# EAGLE design FloppyCircuits_X01 (EAGLE 9.5.1)
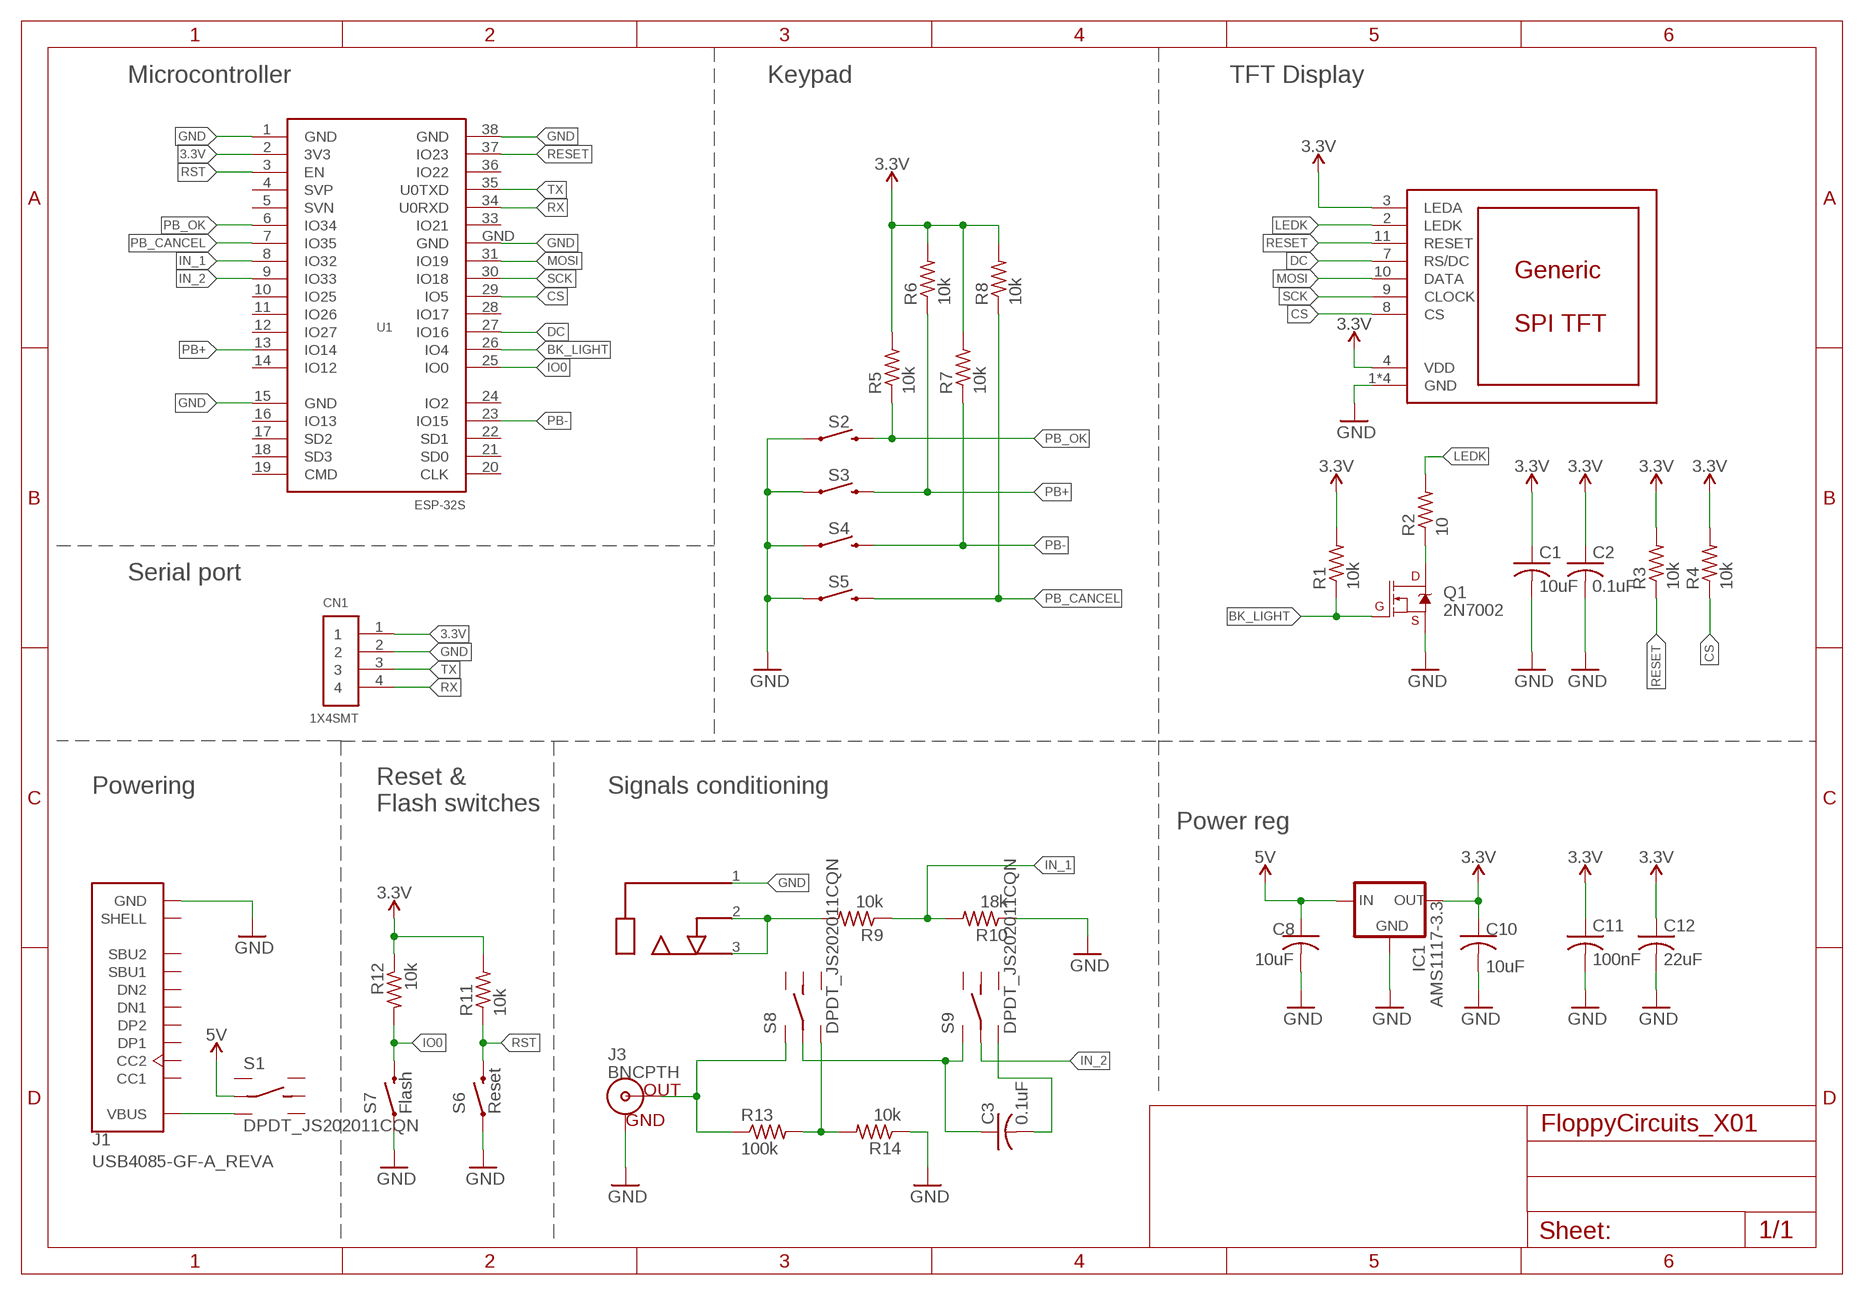
[diagram p0: schematic, sheet 1]

## Parts
C1  10uF  C-USC0603  [C0603]
C2  0.1uF  C-USC0603  [C0603]
C3  0.1uF  C-USC0603  [C0603]
C8  10uF  C-USC0603  [C0603]
C10  10uF  C-USC0603  [C0603]
C11  100nF  C-USC0603  [C0603]
C12  22uF  C-USC0603  [C0603]
CN1  1X4SMT  [1X4-SMT]
DISP1  DISP_LCD_GENERIC_SPI_1.69_WRAPUNDER  [TFT_1.69IN_240X280_12P]
IC1  AMS1117-3.3  V_REG_LD1117VXXLD1117-SMD  [SOT223]
J1  USB4085-GF-A_REVA  [GCT_USB4085-GF-A_REVA]
J2  AUDIO_JACK_MONO_3.5  [PJ316_3.5]
J3  BNCPTH  [BNC]
Q1  2N7002  MOSFET-NCH-BSS138  [SOT23-3]
R1  10k  R-US_R0603  [R0603]
R2  10  R-US_R0603  [R0603]
R3  10k  R-US_R0603  [R0603]
R4  10k  R-US_R0603  [R0603]
R5  10k  R-US_R0603  [R0603]
R6  10k  R-US_R0603  [R0603]
R7  10k  R-US_R0603  [R0603]
R8  10k  R-US_R0603  [R0603]
R9  10k  R-US_R0603  [R0603]
R10  18k  R-US_R0603  [R0603]
R11  10k  R-US_R0603  [R0603]
R12  10k  R-US_R0603  [R0603]
R13  100k  R-US_R0603  [R0603]
R14  10k  R-US_R0603  [R0603]
S1  DPDT_JS202011CQN  [DPDT_JS202011CQN]
S2  MOMENTARY-SWITCH-SPST-PTH-6.0MM  [TACTILE_SWITCH_PTH_6.0MM]
S3  MOMENTARY-SWITCH-SPST-PTH-6.0MM  [TACTILE_SWITCH_PTH_6.0MM]
S4  MOMENTARY-SWITCH-SPST-PTH-6.0MM  [TACTILE_SWITCH_PTH_6.0MM]
S5  MOMENTARY-SWITCH-SPST-PTH-6.0MM  [TACTILE_SWITCH_PTH_6.0MM]
S6  Reset  MOMENTARY-SWITCH-SPST-SMD-5.2MM-TALL  [TACTILE_SWITCH_SMD_5.2MM]
S7  Flash  MOMENTARY-SWITCH-SPST-SMD-5.2MM-TALL  [TACTILE_SWITCH_SMD_5.2MM]
S8  DPDT_JS202011CQN  [DPDT_JS202011CQN]
S9  DPDT_JS202011CQN  [DPDT_JS202011CQN]
U1  ESP-32S  [ESP-32S]

## Nets
3.3V [power]: C1.1 C2.1 C10.1 C11.1 C12.1 CN1.1 DISP1.3(LEDA) DISP1.4(VDD) IC1.2(OUT) R1.2 R3.2 R4.2 R5.2 R6.2 R7.2 R8.2 R11.2 R12.1 U1.2(3V3)
5V: C8.1 IC1.3(IN) S1.2(LC)
BK_LIGHT: Q1.1(G) R1.1 U1.26(IO4)
CS: DISP1.8(CS) R4.1 U1.29(IO5)
DC: DISP1.7(RS/DC) U1.27(IO16)
GND: C1.2 C2.2 C8.2 C10.2 C11.2 C12.2 CN1.2 DISP1.1(GND) DISP1.5(GND) DISP1.6(GND) DISP1.12(GND) IC1.1(GND) J1.A1(GND) J1.A12(GND) J1.B1(GND) J1.B12(GND) J2.1 J3.GND Q1.2(S) R10.1 R14.1 S2.1 S3.1 S4.1 S5.1 S6.1 S7.1 U1.1(GND) U1.15(GND) U1.38(GND) U1.GND
IN_1: R9.1 R10.2 U1.8(IO32)
IN_2: S9.2(LC) U1.9(IO33)
INPUT: J2.2 J2.3 R9.2
IO0: R12.2 S7.3 U1.25(IO0)
LEDK: DISP1.2(LEDK) R2.2
MOSI: DISP1.10(DATA) U1.31(IO19)
N$1: Q1.3(D) R2.1
N$2: J3.S(OUT) R13.1 S8.1(L1)
N$3: R13.2 R14.2 S8.3(L2)
N$5: J1.A4(VBUS) J1.A9(VBUS) J1.B4(VBUS) J1.B9(VBUS) S1.3(L2)
N$6: C3.1 S8.2(LC) S9.1(L1)
N$8: C3.2 S9.3(L2)
PB+: R6.1 S3.3 U1.13(IO14)
PB-: R7.1 S4.3 U1.23(IO15)
PB_CANCEL: R8.1 S5.3 U1.7(IO35)
PB_OK: R5.1 S2.3 U1.6(IO34)
RESET: DISP1.11(RESET) R3.1 U1.37(IO23)
RST: R11.1 S6.3 U1.3(EN)
RX: CN1.4 U1.34(U0RXD)
SCK: DISP1.9(CLOCK) U1.30(IO18)
TX: CN1.3 U1.35(U0TXD)
Unconnected: J1.A5(CC1) J1.A6(DP1) J1.A7(DN1) J1.A8(SBU1) J1.B5(CC2) J1.B6(DP2) J1.B7(DN2) J1.B8(SBU2) J1.P1(SHELL) J1.P2(SHELL) J1.P3(SHELL) J1.P4(SHELL) S1.1(L1) S1.4(R1) S1.5(RC) S1.6(R2) S8.4(R1) S8.5(RC) S8.6(R2) S9.4(R1) S9.5(RC) S9.6(R2) U1.4(SVP) U1.5(SVN) U1.10(IO25) U1.11(IO26) U1.12(IO27) U1.14(IO12) U1.16(IO13) U1.17(SD2) U1.18(SD3) U1.19(CMD) U1.20(CLK) U1.21(SD0) U1.22(SD1) U1.24(IO2) U1.28(IO17) U1.33(IO21) U1.36(IO22)

## Notes on the sheet
- Microcontroller | Keypad | TFT Display
- Serial port
- Powering | Signals conditioning
- Reset & 
  Flash switches
- Power reg

## Library data of the parts
C1-C3 C8 C10-C12 = rcl:C-US: CAPACITOR, American symbol; SPICEPREFIX: C
CN1 = adafruit:1X4: 4-pin connector
DISP1 = adafruit_display:DISP_LCD_GENERIC_SPI
IC1 = SparkFun-IC-Power:V_REG_LD1117VXX: LD1117VXX voltage regulator. We carry the 3.3V version (COM-00526) in TO-220 package.; PROD_ID: VREG-13917
J1 = SpaceDIY_connectors:USB4085-GF-A_REVA: USB 2.0 Type C Receptacle Dip Type, PCB Top Mount Check prices <https://pricing.snapeda.com/parts/USB4085-GF-A/Global%20Connector%20Technology/view-part?ref=eda>; AVAILABILITY: In Stock; DESCRIPTION: USB-C (USB TYPE-C) USB 2.0 Receptacle Connector 24 (16+8 Dummy) Position Through Hole, Right Angle, low cost, 3.46mm profile, 16 pin, horizontal, Top mount; MF: Global Connector Technology; MP: USB4085-GF-A; PACKAGE: None; PRICE: None; PURCHASE-URL: https://pricing.snapeda.com/search/part/USB4085-GF-A/?ref=eda
J2 = SpaceDIY_connectors:AUDIO_JACK_MONO_3.5
J3 = SparkFun:BNC: BNC Connector, Mouser Part# 5227161
Q1 = SparkFun-DiscreteSemi:MOSFET-NCH: N-channel MOSFETs Voltage controlled devices that allow control of high current outputs. SparkFun Products: SparkFun OpenScale <https://www.sparkfun.com/products/13261> SparkFun Digital Sandbox <https://www.sparkfun.com/products/12651> SparkFun Monster Moto Shield <https://www.sparkfun.com/products/10182> SparkFun MOSFET Power Controller <https://www.sparkfun.com/products/11214>; PROD_ID: TRANS-00830; VALUE: 220mA/50V/3.5Ω
R1-R14 = rcl:R-US_: RESISTOR, American symbol; SPICEPREFIX: R
S1 S8 S9 = bt_electromech:DPDT: Dual Position, Dual Throw (DPDT) Switch
S2-S5 = SparkFun-Switches:MOMENTARY-SWITCH-SPST: Momentary Switch (Pushbutton) - SPST Normally-open (NO) SPST momentary switches (buttons, pushbuttons). Variants PTH-12MM - 12mm square, through-hole Momentary Pushbutton Switch - 12mm Square <https://www.sparkfun.com/products/9190> (COM-09190) PTH-6.0MM, PTH-6.0MM-KIT - 6.0mm square, through-hole Mini Pushbutton Switch <https://www.sparkfun.com/products/97> (COM-00097) KIT package intended for soldering kit's - only one side of pads' copper is exposed. PTH-RIGHT-ANGLE-KIT - Right-angle, through-hole Right Angle Tactile Button <https://www.sparkfun.com/products/10791> - Used on SparkFun BigTime Watch Kit <https://www.sparkfun.com/products/11734> SMD-12MM - 12mm square, surface-mount Tactile Button - SMD (12mm) <https://www.sparkfun.com/products/12993> (COM-12993) Used on SparkFun PicoBoard <https://www.sparkfun.com/products/11888> SMD-4.5MM - 4.5mm Square Trackball Switch Used on SparkFun Blackberry Trackballer Breakout <https://www.sparkfun.com/products/13169> SMD-4.6MMX2.8MM - 4.60mm x 2.80mm, surface mount Used on SparkFun Pro Micro - RP2040 <https://www.sparkfun.com/products/17717> SMD-5.2MM, SMD-5.2-REDUNDANT - 5.2mm square, surface-mount Mini Pushbutton Switch - SMD <https://www.sparkfun.com/products/8720> (COM-08720) Used on Arduino Pro Mini <https://www.sparkfun.com/products/11114> REDUNDANT package connects both switch circuits together SMD-6.0X3.5MM - 6.0 x 3.5mm, surface mount Momentary Reset Switch SMD <https://www.sparkfun.com/products/8229> (COM-08229) SMD-6.2MM-TALL - 6.2mm square, surface mount Tactile Button - SMD (6mm) <https://www.sparkfun.com/products/12992> Used on SparkFun Digital Sandbox <https://www.sparkfun.com/products/12651> SMD-RIGHT-ANGLE - Right-angle, surface mount Used on SparkFun Block for Intel® Edison - Arduino <https://www.sparkfun.com/products/13036>; PROD_ID: SWCH-08441; SF_SKU: COM-00097
S6 S7 = SpaceDIY_electromechanical:MOMENTARY-SWITCH-SPST: Momentary Switch (Pushbutton) - SPST Normally-open (NO) SPST momentary switches (buttons, pushbuttons). Variants PTH-12MM - 12mm square, through-hole Momentary Pushbutton Switch - 12mm Square <https://www.sparkfun.com/products/9190> (COM-09190) PTH-6.0MM, PTH-6.0MM-KIT - 6.0mm square, through-hole Mini Pushbutton Switch <https://www.sparkfun.com/products/97> (COM-00097) KIT package intended for soldering kit's - only one side of pads' copper is exposed. PTH-RIGHT-ANGLE-KIT - Right-angle, through-hole Right Angle Tactile Button <https://www.sparkfun.com/products/10791> - Used on SparkFun BigTime Watch Kit <https://www.sparkfun.com/products/11734> SMD-12MM - 12mm square, surface-mount Tactile Button - SMD (12mm) <https://www.sparkfun.com/products/12993> (COM-12993) Used on SparkFun PicoBoard <https://www.sparkfun.com/products/11888> SMD-4.5MM - 4.5mm Square Trackball Switch Used on SparkFun Blackberry Trackballer Breakout <https://www.sparkfun.com/products/13169> SMD-4.6MMX2.8MM - 4.60mm x 2.80mm, surface mount Used on SparkFun Pro Micro - RP2040 <https://www.sparkfun.com/products/17717> SMD-5.2MM, SMD-5.2-REDUNDANT - 5.2mm square, surface-mount Mini Pushbutton Switch - SMD <https://www.sparkfun.com/products/8720> (COM-08720) Used on Arduino Pro Mini <https://www.sparkfun.com/products/11114> REDUNDANT package connects both switch circuits together SMD-6.0X3.5MM - 6.0 x 3.5mm, surface mount Momentary Reset Switch SMD <https://www.sparkfun.com/products/8229> (COM-08229) SMD-6.2MM-TALL - 6.2mm square, surface mount Tactile Button - SMD (6mm) <https://www.sparkfun.com/products/12992> Used on SparkFun Digital Sandbox <https://www.sparkfun.com/products/12651> SMD-RIGHT-ANGLE - Right-angle, surface mount Used on SparkFun Block for Intel® Edison - Arduino <https://www.sparkfun.com/products/13036>; LCSC: C318884; PROD_ID: SWCH-14139
U1 = esp32:ESP-32S: Ai-Thinker ESP-32S

## Net classes
1 power: width 0.254 mm

## Board
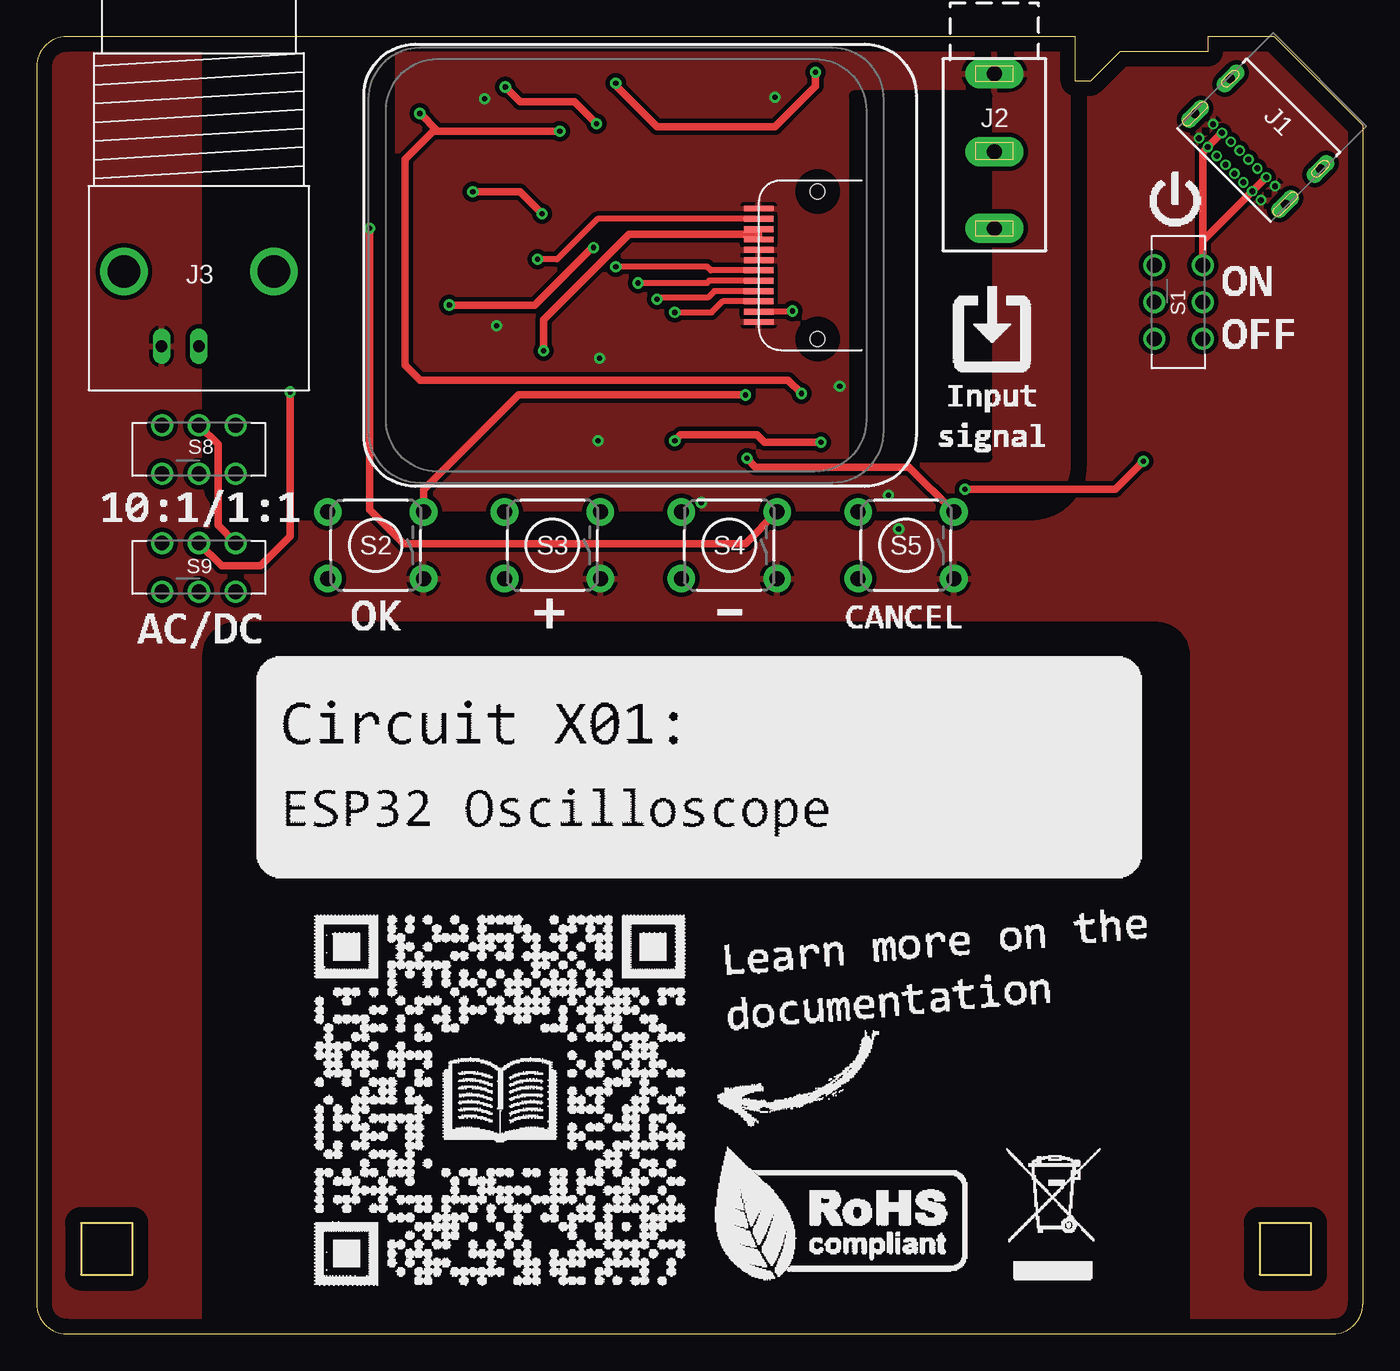
[diagram p1: board, top side]
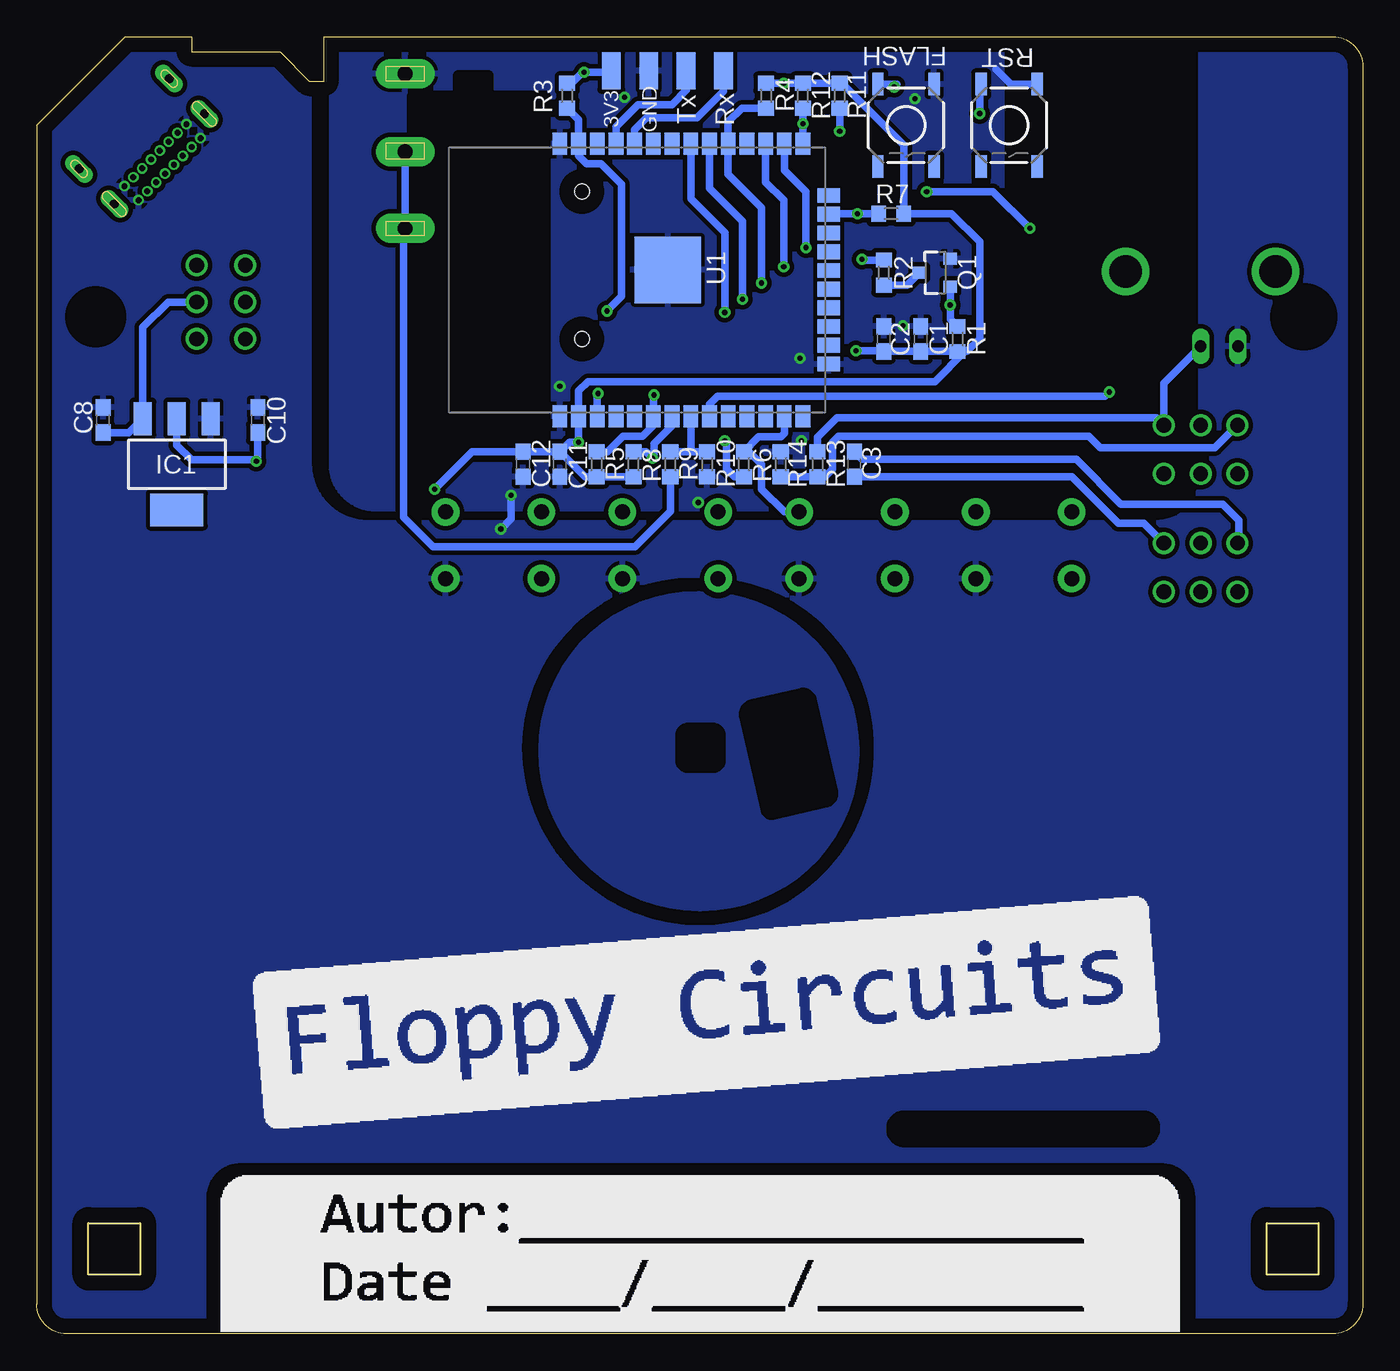
[diagram p2: board, bottom side, seen from below]

Size 90 x 88 mm. Coordinates in mm from the lower left corner, seen from the top.
Outline: 0,2 arc90 2,0 88,0 arc90 90,2 90,82 84,88 79.5,88 79.5,87 73.5,87 71.5,85 70.5,85 70.5,88 2,88 arc90 0,86 0,2
Outline: 3,4 6.5,4 6.5,7.5 3,7.5 3,4
Outline: 83,4 86.5,4 86.5,7.5 83,7.5 83,4
Copper layers (1*16): Top 0.035mm / dielectric 1.5mm / Bottom 0.035mm
Design rules "default *": minimum track width 6mil, minimum drill 0.35mm, track to track 6mil, track to pad 6mil, pad to pad 6mil, via to via 4mil, smd to smd 6mil, copper to edge 40mil, drill to drill 4mil, minimum pad ring 6mil, minimum via ring 8mil, stop-mask expansion 4mil, vias tented up to drill 0mil, thermal gap 10mil
tRestrict: area 55.5,59.5 to 64.5,84
bRestrict: area 55.5,59.5 to 64.5,85.4; area 36.1,35.3 to 41.9,43.4; area 43.7,38.5 to 46.2,41; area 14.1,13 to 32,14.8; area 3.3,68.3 to 4.7,69.7; area 85.5,68.5 to 86.5,69.5

### Footprints (pad centres in the part's own frame; a part is rotated, then mirrored left to right if it is on the bottom)
C0603 = smd 1.1 x 1: 1 -0.85,0; 2 0.85,0
1X4-SMT = smd 1.27 x 2.54: 1 -3.81,0; 2 -1.27,0; 3 1.27,0; 4 3.81,0
TFT_1.69IN_240X280_12P = smd 0.4 x 2: 1 3.85,-9; 2 3.15,-9; 3 2.45,-9; 4 1.75,-9; 5 1.05,-9; 6 0.35,-9; 7 -0.35,-9; 8 -1.05,-9; 9 -1.75,-9; 10 -2.45,-9; 11 -3.15,-9; 12 -3.85,-9 | hole 1: -5,-13; 5,-13
SOT223 = smd 1.219 x 2.235: 1 -2.311,-3.099; 2 0,-3.099; 3 2.311,-3.099 | smd 3.6 x 2.2: 4 0,3.099
GCT_USB4085-GF-A_REVA = drill 0.4 pad 0.65: A1 -2.975,4.025; A4 -2.125,4.025; A5 -1.275,4.025; A6 -0.425,4.025; A7 0.425,4.025; A8 1.275,4.025; A9 2.125,4.025; A12 2.975,4.025; B1 2.975,2.675; B4 2.125,2.675; B5 1.275,2.675; B6 0.425,2.675; B7 -0.425,2.675; B8 -1.275,2.675; B9 -2.125,2.675; B12 -2.975,2.675 | drill 0.6 pad 1.108 long: P1 -4.325,3.045; P2 4.325,3.045; P3 4.325,-0.335; P4 -4.325,-0.335
PJ316_3.5 = drill 1 pad 2 long: 1 0,1; 2 0,6.3; 3 0,11.5
BNC = drill 2.2: 3 -5.08,5.08; 4 5.08,5.08 | drill 0.8 long: GND -2.54,0; S 0,0
SOT23-3 = smd 0.8 x 0.9: 1 -0.95,-1; 2 0.95,-1; 3 0,1.1
R0603 = smd 1 x 1.1: 1 -0.85,0; 2 0.85,0
DPDT_JS202011CQN = drill 1: 1 -2.5,-1.65; 2 0,-1.651; 3 2.5,-1.65; 4 -2.5,1.65; 5 0,1.651; 6 2.5,1.65
TACTILE_SWITCH_PTH_6.0MM = drill 1.016 pad 1.88: 1 -3.251,2.261; 2 3.251,2.261; 3 -3.251,-2.261; 4 3.251,-2.261
TACTILE_SWITCH_SMD_5.2MM = smd 1.524 x 0.762: 1 -2.794,1.905; 2 2.794,1.905; 3 -2.794,-1.905; 4 2.794,-1.905
ESP-32S = smd 1.5 x 1: 1 -9.25,7; 2 -9.25,5.73; 3 -9.25,4.46; 4 -9.25,3.19; 5 -9.25,1.92; 6 -9.25,0.65; 7 -9.25,-0.62; 8 -9.25,-1.89; 9 -9.25,-3.16; 10 -9.25,-4.43; 11 -9.25,-5.7; 12 -9.25,-6.97; 13 -9.25,-8.24; 14 -9.25,-9.51; 25 9.25,-9.51; 26 9.25,-8.24; 27 9.25,-6.97; 28 9.25,-5.7; 29 9.25,-4.43; 30 9.25,-3.16; 31 9.25,-1.89; 32 9.25,-0.62; 33 9.25,0.65; 34 9.25,1.92; 35 9.25,3.19; 36 9.25,4.46; 37 9.25,5.73; 38 9.25,7 | smd 1 x 1.5: 15 -5.7,-11.25; 16 -4.43,-11.25; 17 -3.16,-11.25; 18 -1.89,-11.25; 19 -0.62,-11.25; 20 0.65,-11.25; 21 1.92,-11.25; 22 3.19,-11.25; 23 4.46,-11.25; 24 5.73,-11.25 | smd 4.5 x 4.5: GND 0.68,-0.33

### Placement (x,y rotation side)
C1  30,67.5 90 bottom
C2  32.5,67.5 90 bottom
C3  34.5,59 90 bottom
C8  85.5,62 90 bottom
C10  75,62 90 bottom
C11  54.5,59 270 bottom
C12  57,59 270 bottom
CN1  47.2,85.7 0 bottom
DISP1  40,72.5 90 top
IC1  80.5,59 180 bottom
J1  83.84,81.87 135 top
J2  65,86.5 180 top
J3  11,67 0 top
Q1  29,72 90 bottom
R1  27.5,67.5 270 bottom
R2  32.5,72 90 bottom
R3  54,84 90 bottom
R4  40.5,84 90 bottom
R5  52,59 270 bottom
R6  42,59 270 bottom
R7  32,76 0 bottom
R8  49.5,59 270 bottom
R9  47,59 270 bottom
R10  44.5,59 90 bottom
R11  35.5,84 90 bottom
R12  38,84 270 bottom
R13  37,59 270 bottom
R14  39.5,59 270 bottom
S1  77.5,70 90 top
S2  23,53.5 180 top
S3  35,53.5 180 top
S4  47,53.5 180 top
S5  59,53.5 180 top
S6  24,82 270 bottom
S7  31,82 270 bottom
S8  11,60 180 top
S9  11,52 180 top
U1  47.5,71.5 90 bottom

### Tracks (layer width: path | path; a pad name or v marks a point on that pad's centre or on a via)
3.3V  (via drill 0.35)
  Top 0.406: DISP1.3 DISP1.4
  Top 0.508: DISP1.4 49,74.6 40.2,74.6 34.4,68.8 v34.4,66.7 | v39.3,84.85 39.3,84.7 42.1,81.9 50.1,81.9 52.85,84.65 v52.85,85.6 | v53.23,60.5 49.4,60.5 48.9,61 43.7,61 v43.3,60.6 | v63,57.3 73.2,57.3 v75.1,59.2
  Bottom 0.508: C11.1 53.85,60.5 v53.23,60.5 U1.2 53.23,63.97 52.6,64.6 29.05,64.6 27,66.65 | C11.1 52.8,58.15 R5.2 R8.2 | C11.1 C12.1 60.45,59.85 v63,57.3 | v34.4,66.7 32.55,66.7 C2.1 C1.1 R1.2 27,66.65 | 27,66.65 26.85,66.65 26,67.5 26,74.1 27.9,76 R7.2 31.15,80.65 35.35,84.85 R11.2 R12.1 v39.3,84.85 R4.2 | R3.2 53.7,84.85 52.95,85.6 v52.85,85.6 51.11,85.6 CN1.1 | v43.3,60.6 43.2,60.5 43.2,58.7 42.65,58.15 R6.2 | v75.1,59.2 75,59.3 | 75,59.3 C10.1 | IC1.2 80.5,60.3 79.5,59.3 75,59.3
5V
  Bottom 0.508: C8.1 83.76,61.15 IC1.3 82.81,68.29 81.1,70 S1.2
BK_LIGHT  (via drill 0.35)
  Top 0.508: v37.8,73.7 37.75,73.75 33.8,69.8 v28,69.8
  Bottom 0.508: R1.1 28,68.85 v28,69.8 Q1.1 | U1.26 39.26,78.96 37.8,77.5 v37.8,73.7
CS  (via drill 0.35)
  Top 0.406: v40.8,71.3 45.5,71.3 45.65,71.45 DISP1.8
  Bottom 0.508: v40.8,71.3 40.8,76.4 43.07,78.67 U1.29 43.07,82.23 42.15,83.15 R4.1
DC  (via drill 0.35)
  Top 0.406: DISP1.7 45.75,72.15 45.5,72.4 v39.3,72.4
  Bottom 0.508: U1.27 40.53,78.13 39.3,76.9 v39.3,72.4
GND  (via drill 0.35)
  Bottom 0.508: S6.1 23.89,84.79 24.9,85.8 | v57.8,56.9 57.8,55.3 v58.5,54.6
  other vias: 31.2,68.4 38.2,66.2 38.1,60.6 45.1,56.4 54.5,64.3 30.4,83.8 50.1,83.9
  pour Top (isolate 0.305): 24.5,88 24.5,59 arc90 27.5,56 67,56 arc90 70,59 70,88
  pour Top (isolate 0.305): 11,88.5 11,58 arc90 14,55 67.5,55 arc90 71.5,59 71.5,88 91.5,88 91.5,-3 78.5,-3 78.5,46 arc90 76,48.5 13.5,48.5 arc90 11,46 11,-2.5 -2,-2.5 -2,88.5
  pour Bottom (isolate 0.305): 11,88.5 11,58 arc90 14,55 67.5,55 arc90 71.5,59 71.5,88 91.5,88 91.5,-3 78.67,-3 78.67,9.29 arc90 76.17,11.79 45,11.79 45,27.5 arc90 57.25,39.75 arc90 45.5,51.5 44.5,51.5 arc90 33,40 33,39.46 arc90 44.96,27.5 44.96,11.79 13.67,11.79 arc90 11.17,9.29 11.17,-2.5 -2,-2.5 -2,88.5
  pour Bottom (isolate 0.305): 70,88 70,59 arc-90 67,56 27.5,56 arc-90 24.5,59 24.5,88
GND_2
  pour Bottom (isolate 0.406): 44.98,50.35 arc90 34.2,39.58 34.2,39.41 arc90 44.89,28.71 45.06,28.71 arc90 55.92,39.58 arc90 45.15,50.35
IN_1
  Bottom 0.508: R10.2 45.7,59.85 | 45.7,59.85 R9.1 | U1.8 45.61,59.94 45.7,59.85
IN_2  (via drill 0.35)
  Top 0.508: S9.2 12.55,52.1 15.2,52.1 17.2,54.1 v17.2,63.9
  Bottom 0.508: v17.2,63.9 17.5,63.6 43.8,63.6 44.34,63.06 U1.9
INPUT
  Bottom 0.508: J2.2 65,75.3 | 65,75.3 J2.3 | R9.2 47,55.8 49.4,53.4 63.1,53.4 65.1,55.4 65.1,75.2 65,75.3
IO0  (via drill 0.35)
  Top 0.508: v31.8,84.6 32.8,83.6 36.5,83.6 v38,82.1
  Bottom 0.508: R12.2 v38,82.1 U1.25 | v31.8,84.6 31.61,84.79 S7.3
LEDK  (via drill 0.35)
  Top 0.406: DISP1.2 38.05,75.65 35.3,72.9 v34,72.9
  Bottom 0.508: R2.2 33.95,72.85 v34,72.9
MOSI  (via drill 0.35)
  Top 0.406: v43.3,69.3 45.8,69.3 46.55,70.05 DISP1.10
  Bottom 0.508: U1.31 45.61,77.01 43.3,74.7 v43.3,69.3
N$1
  Bottom 0.508: R2.1 30.95,71.15 Q1.3
N$2
  Bottom 0.508: J3.S 13.5,64.5 S8.1 14,62.15 35.68,62.15 37,60.83 R13.1
N$3
  Bottom 0.508: S8.3 10.05,60.1 17.8,60.1 18.6,60.9 35.6,60.9 36,60.5 36,58.65 36.5,58.15 R13.2 R14.2
N$5
  Top 0.508: J1.B9 J1.A4 79.15,74.17 | 79.15,74.17 79.15,74 S1.3 | J1.B4 J1.A9 79.15,80.19 79.15,74.17
N$6
  Top 0.508: S9.1 12.3,54.85 12.3,60.35 S8.2
  Bottom 0.508: S9.1 14.85,55 16.6,55 19.75,58.15 C3.1
N$8
  Bottom 0.508: C3.2 34,59.35 19.45,59.35 16.4,56.3 9.5,56.3 8.4,55.2 8.4,53.75 S9.3
PB+
  Bottom 0.508: U1.13 39.26,61.09 39.5,60.85 41,60.85 R6.1 41.65,59.85 40.8,59 40.8,57.31 39.25,55.76 S3.3
PB-  (via drill 0.35)
  Top 0.508: v22.6,75 22.6,55.9 24.9,53.6 48.09,53.6 S4.3 | v29.6,77.5 32.8,77.5 v34.3,76
  Bottom 0.508: R7.1 v34.3,76 36.21,76 U1.23 | v22.6,75 25.1,77.5 v29.6,77.5
PB_CANCEL  (via drill 0.35)
  Top 0.508: S5.3 59.21,58.8 48.8,58.8 v48.2,59.4
  Bottom 0.508: R8.1 48.65,59.85 v48.2,59.4 48.1,59.5 48.1,60.4 46.88,61.62 U1.7
PB_OK  (via drill 0.35)
  Top 0.508: S2.3 26.25,57.25 32.7,63.7 v48.1,63.7
  Bottom 0.508: R5.1 51.25,59.85 50.2,60.9 48.9,60.9 48.15,61.65 U1.6 48.15,63.65 v48.1,63.7
RESET  (via drill 0.35)
  Top 0.406: v51.3,69.4 51.25,69.35 DISP1.11
  Bottom 0.508: R3.1 53.23,82.38 U1.37 53.23,79.93 52.7,79.4 51.7,79.4 50.3,78 50.3,70.4 v51.3,69.4
RST  (via drill 0.35)
  Top 0.508: v35.5,81.6 27.2,81.6 | 27.2,81.6 v26,82.8 | v51.9,63.8 51,64.7 26,64.7 25,65.7 25,79.7 26.9,81.6 27.2,81.6
  Bottom 0.508: R11.1 v35.5,81.6 | v26,82.8 26,84.7 S6.3 | U1.3 51.96,63.74 v51.9,63.8
RX
  Bottom 0.508: U1.34 49.42,81.68 48.6,82.5 45.2,82.5 43.39,84.31 CN1.4
SCK  (via drill 0.35)
  Top 0.406: DISP1.9 46,70.75 45.55,70.3 42.2,70.3 v42.1,70.2
  Bottom 0.508: U1.30 44.34,77.74 42.1,75.5 v42.1,70.2
TX
  Bottom 0.508: U1.35 50.69,81.91 49.2,83.4 46.9,83.4 45.9,84.4 45.9,85.67 CN1.3

### Text on the board
bNames: RST | FLASH | Rx | Tx | GND | 3V3